# EAGLE schematic FAJAS_V2 (EAGLE 9.6.2)
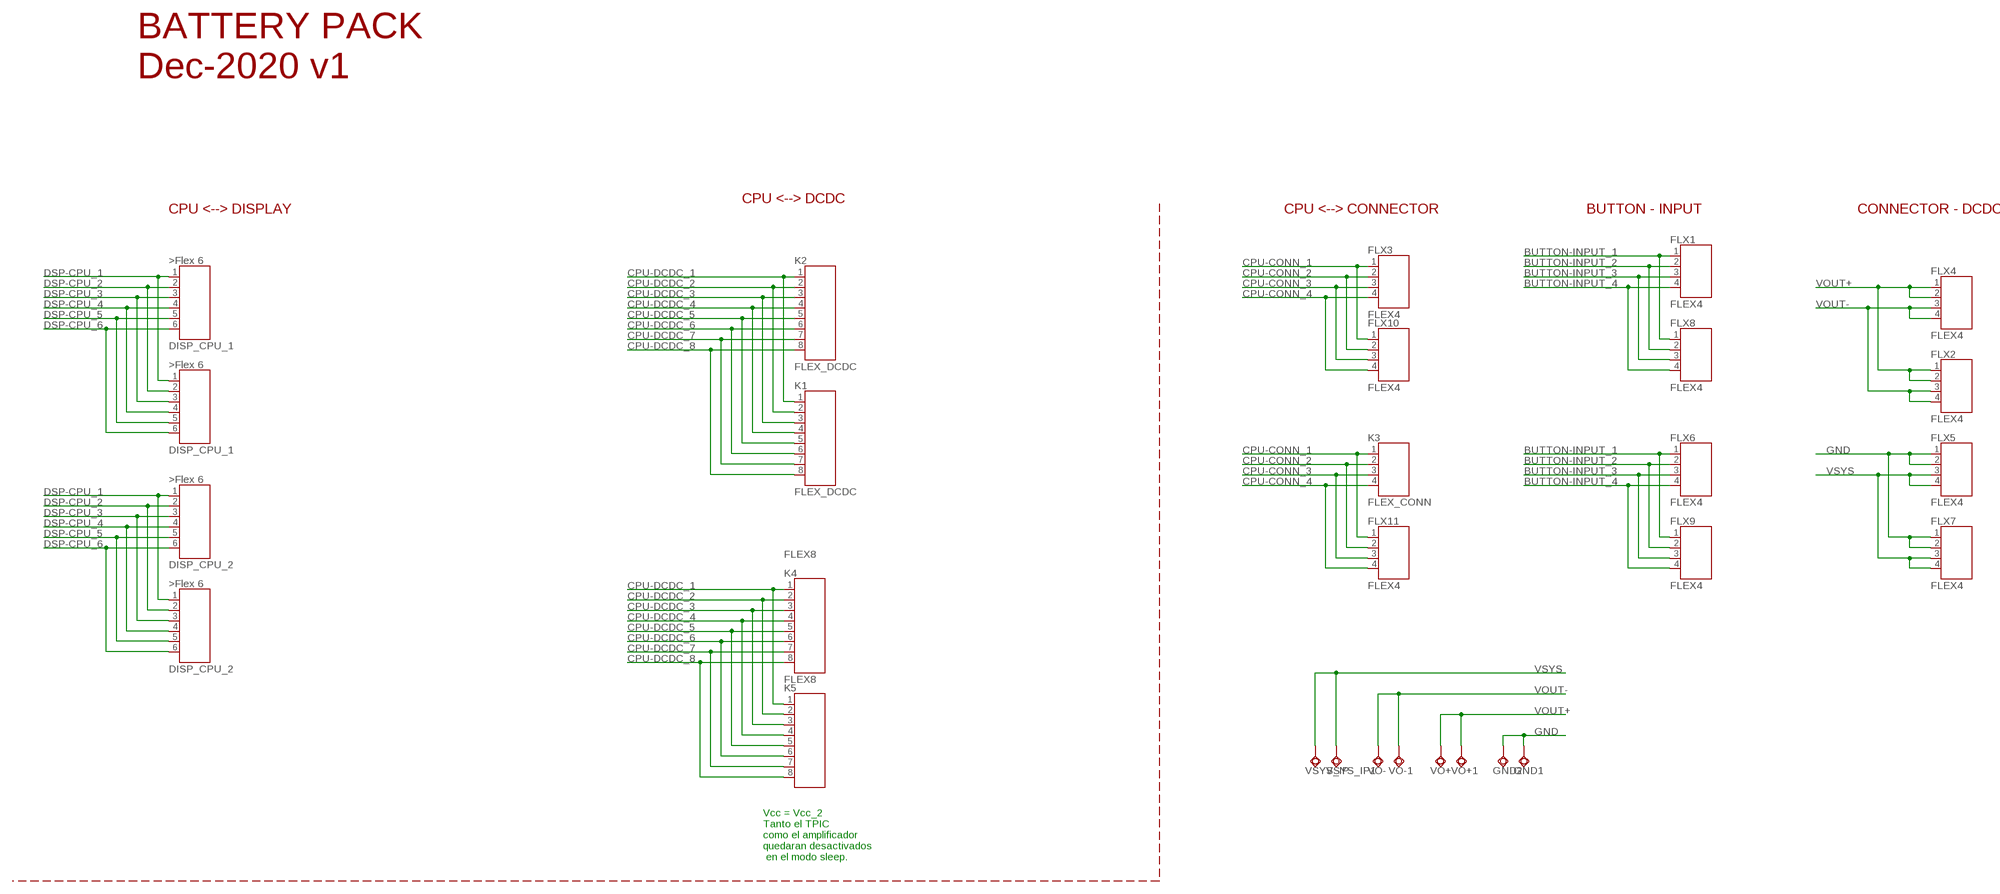
[diagram p0: schematic, sheet 1]

## Parts
DISP_CPU_1  DISP_CPU_1  FLEX6  [FLEX6]
DISP_CPU_2  DISP_CPU_2  FLEX6  [FLEX6]
DISP_CPU_3  DISP_CPU_2  FLEX6  [FLEX6]
DISP_CPU_4  DISP_CPU_1  FLEX6  [FLEX6]
FLX1  FLEX4  [FLEX4]
FLX2  FLEX4  [FLEX4]
FLX3  FLEX4  [FLEX4]
FLX4  FLEX4  [FLEX4]
FLX5  FLEX4  [FLEX4]
FLX6  FLEX4  [FLEX4]
FLX7  FLEX4  [FLEX4]
FLX8  FLEX4  [FLEX4]
FLX9  FLEX4  [FLEX4]
FLX10  FLEX4  [FLEX4]
FLX11  FLEX4  [FLEX4]
GND1  TESTPAD_TPSQTP15SQ  [TESTPAD_TP15SQ]
GND2  TESTPAD_TPSQTP15SQ  [TESTPAD_TP15SQ]
K1  FLEX_DCDC  FLEX8  [FLEX8]
K2  FLEX_DCDC  FLEX8  [FLEX8]
K3  FLEX_CONN  FLEX4  [FLEX4]
K4  FLEX8  [FLEX8]
K5  FLEX8  [FLEX8]
VO+  TESTPAD_TPSQTP15SQ  [TESTPAD_TP15SQ]
VO+1  TESTPAD_TPSQTP15SQ  [TESTPAD_TP15SQ]
VO-  TESTPAD_TPSQTP15SQ  [TESTPAD_TP15SQ]
VO-1  TESTPAD_TPSQTP15SQ  [TESTPAD_TP15SQ]
VSYS_IP  TESTPAD_TPSQTP15SQ  [TESTPAD_TP15SQ]
VSYS_IP1  TESTPAD_TPSQTP15SQ  [TESTPAD_TP15SQ]

## Nets
BUTTON-INPUT_1: FLX1.1 FLX6.1 FLX8.1 FLX9.1
BUTTON-INPUT_2: FLX1.2 FLX6.2 FLX8.2 FLX9.2
BUTTON-INPUT_3: FLX1.3 FLX6.3 FLX8.3 FLX9.3
BUTTON-INPUT_4: FLX1.4 FLX6.4 FLX8.4 FLX9.4
CPU-CONN_1: FLX3.1 FLX10.1 FLX11.1 K3.1
CPU-CONN_2: FLX3.2 FLX10.2 FLX11.2 K3.2
CPU-CONN_3: FLX3.3 FLX10.3 FLX11.3 K3.3
CPU-CONN_4: FLX3.4 FLX10.4 FLX11.4 K3.4
CPU-DCDC_1: K1.1 K2.1 K4.1 K5.1
CPU-DCDC_2: K1.2 K2.2 K4.2 K5.2
CPU-DCDC_3: K1.3 K2.3 K4.3 K5.3
CPU-DCDC_4: K1.4 K2.4 K4.4 K5.4
CPU-DCDC_5: K1.5 K2.5 K4.5 K5.5
CPU-DCDC_6: K1.6 K2.6 K4.6 K5.6
CPU-DCDC_7: K1.7 K2.7 K4.7 K5.7
CPU-DCDC_8: K1.8 K2.8 K4.8 K5.8
DSP-CPU_1: DISP_CPU_1.1 DISP_CPU_2.1 DISP_CPU_3.1 DISP_CPU_4.1
DSP-CPU_2: DISP_CPU_1.2 DISP_CPU_2.2 DISP_CPU_3.2 DISP_CPU_4.2
DSP-CPU_3: DISP_CPU_1.3 DISP_CPU_2.3 DISP_CPU_3.3 DISP_CPU_4.3
DSP-CPU_4: DISP_CPU_1.4 DISP_CPU_2.4 DISP_CPU_3.4 DISP_CPU_4.4
DSP-CPU_5: DISP_CPU_1.5 DISP_CPU_2.5 DISP_CPU_3.5 DISP_CPU_4.5
DSP-CPU_6: DISP_CPU_1.6 DISP_CPU_2.6 DISP_CPU_3.6 DISP_CPU_4.6
GND: FLX5.1 FLX5.2 FLX7.1 FLX7.2 GND1.TP GND2.TP
VOUT+: FLX2.1 FLX2.2 FLX4.1 FLX4.2 VO+1.TP VO+.TP
VOUT-: FLX2.3 FLX2.4 FLX4.3 FLX4.4 VO-1.TP VO-.TP
VSYS: FLX5.3 FLX5.4 FLX7.3 FLX7.4 VSYS_IP1.TP VSYS_IP.TP

## Notes on the sheet
- BATTERY PACK
  Dec-2020 v1
- CPU <--> DCDC
- CPU <--> DISPLAY | CPU <--> CONNECTOR | BUTTON - INPUT | CONNECTOR - DCDC
- Vcc = Vcc_2
  Tanto el TPIC 
  como el amplificador
  quedaran desactivados
   en el modo sleep.

## Library data of the parts
DISP_CPU_1-DISP_CPU_4 = Flex_Faja_connector:FLEX6: WR-FPC 1mm SMT Horiz. Bot. Contact Hinge type WR-FPC 1mm 06 pins Hinge type SMT Horizontal Bottom Contact ;=>Code : Con_FPC_ZIF_1.00_6861xx148922_686106148922 <http://katalog.we-online.de/media/images/eican/Con_FPC_ZIF_1.00_686110148922_pf2.jpg> Details see: http://katalog.we-online.de/em/datasheet/6861xx148922.pdf Created 2014-10-08, Karrer Zheng 2014 (C) Wurth Elektronik
FLX1-FLX11 K3 = Flex4:FLEX4
GND1 GND2 VO+ VO+1 VO- VO-1 VSYS_IP VSYS_IP1 = BeagleBone_Blue_R3:TESTPAD_TPSQ: Test pad
K1 K2 K4 K5 = Flex_Faja_connector:FLEX8: WR-FPC 1mm SMT Horiz. Bot. Contact Hinge type WR-FPC 1mm 08 pins Hinge type SMT Horizontal Bottom Contact ;=>Code : Con_FPC_ZIF_1.00_6861xx148922_686108148922 <http://katalog.we-online.de/media/images/eican/Con_FPC_ZIF_1.00_686110148922_pf2.jpg> Details see: http://katalog.we-online.de/em/datasheet/6861xx148922.pdf Created 2014-10-08, Karrer Zheng 2014 (C) Wurth Elektronik

## Net classes
1 power: width 0.178 mm
2 gnd: width 0.305 mm, drill 0.483 mm, clearance 0.203 mm